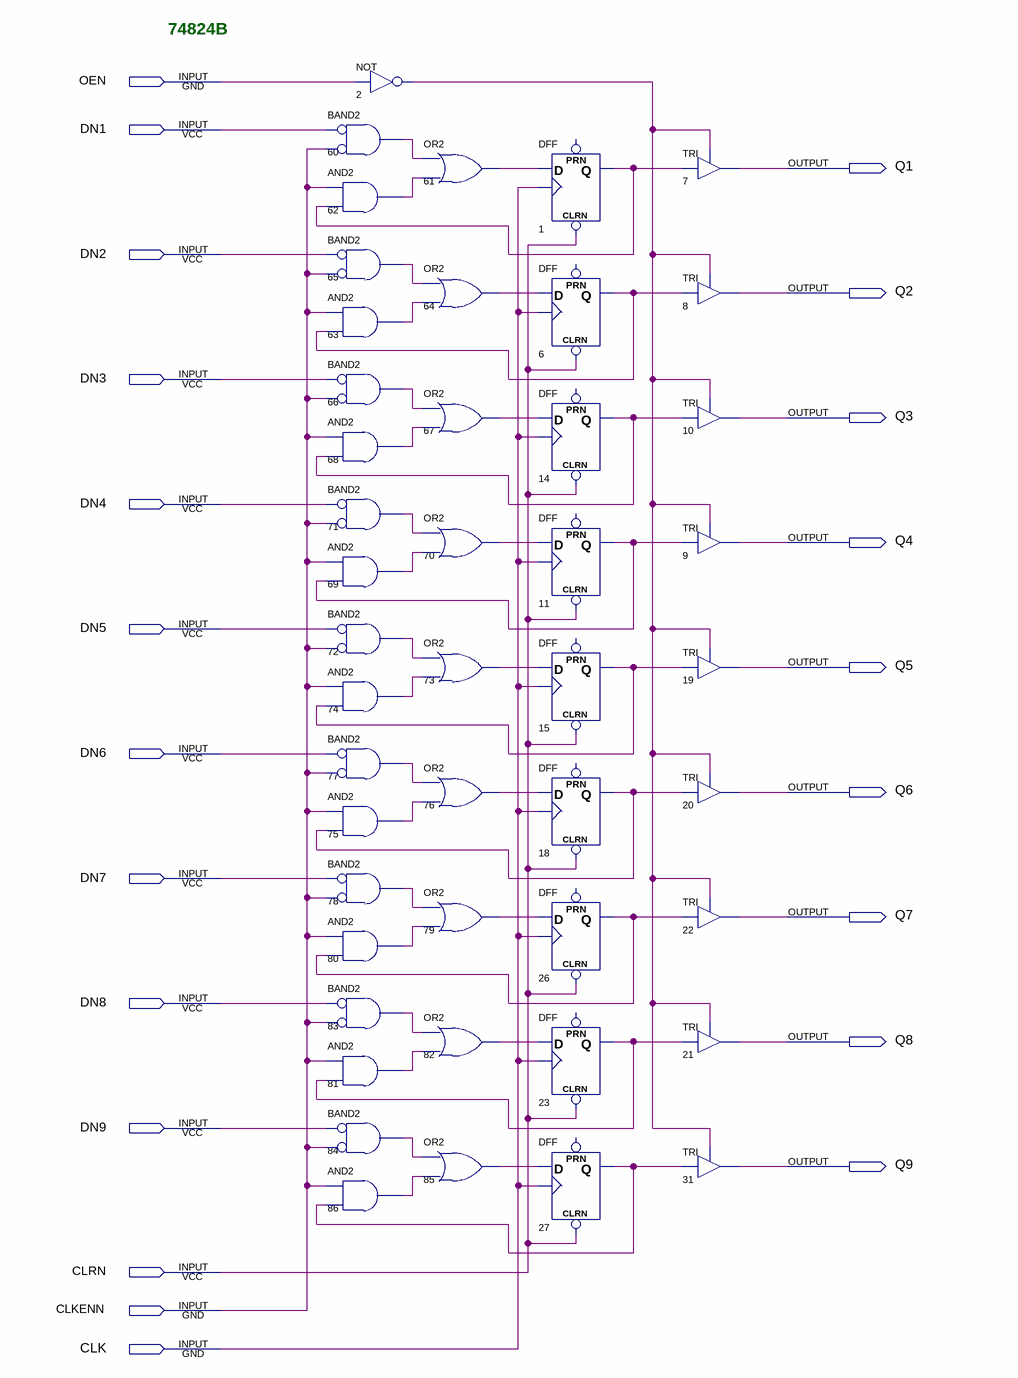
[diagram p0: schematic sheet]
// Quartus schematic 74824b.bdf as structural Verilog: 46 symbols, 22 pins
module \74824b  (
  input  OEN,
  input  DN1,
  input  DN2,
  input  DN3,
  input  DN4,
  input  DN5,
  input  DN6,
  input  DN7,
  input  DN8,
  input  DN9,
  input  CLRN,
  input  CLKENN,
  input  CLK,
  output Q1,
  output Q2,
  output Q3,
  output Q4,
  output Q5,
  output Q6,
  output Q7,
  output Q8,
  output Q9
);

  wire n1_q, n2_out, n6_q, n11_q, n14_q, n15_q, n18_q, n23_q, n26_q, n27_q, n60_out, n61_out, n62_out,
       n63_out, n64_out, n65_out, n66_out, n67_out, n68_out, n69_out, n70_out, n71_out, n72_out, n73_out,
       n74_out, n75_out, n76_out, n77_out, n78_out, n79_out, n80_out, n81_out, n82_out, n83_out, n84_out,
       n85_out, n86_out;

  not u_2 (n2_out, OEN);
  and u_60 (n60_out, ~DN1, ~CLKENN);  // BAND2
  and u_62 (n62_out, CLKENN, n1_q);
  and u_65 (n65_out, ~DN2, ~CLKENN);  // BAND2
  and u_63 (n63_out, CLKENN, n6_q);
  and u_66 (n66_out, ~DN3, ~CLKENN);  // BAND2
  and u_68 (n68_out, CLKENN, n14_q);
  and u_71 (n71_out, ~DN4, ~CLKENN);  // BAND2
  and u_69 (n69_out, CLKENN, n11_q);
  and u_72 (n72_out, ~DN5, ~CLKENN);  // BAND2
  and u_74 (n74_out, CLKENN, n15_q);
  and u_77 (n77_out, ~DN6, ~CLKENN);  // BAND2
  and u_75 (n75_out, CLKENN, n18_q);
  and u_78 (n78_out, ~DN7, ~CLKENN);  // BAND2
  and u_80 (n80_out, CLKENN, n26_q);
  and u_83 (n83_out, ~DN8, ~CLKENN);  // BAND2
  and u_81 (n81_out, CLKENN, n23_q);
  and u_84 (n84_out, ~DN9, ~CLKENN);  // BAND2
  and u_86 (n86_out, CLKENN, n27_q);
  or u_61 (n61_out, n60_out, n62_out);
  or u_64 (n64_out, n65_out, n63_out);
  or u_67 (n67_out, n66_out, n68_out);
  or u_70 (n70_out, n71_out, n69_out);
  or u_73 (n73_out, n72_out, n74_out);
  or u_76 (n76_out, n77_out, n75_out);
  or u_79 (n79_out, n78_out, n80_out);
  or u_82 (n82_out, n83_out, n81_out);
  or u_85 (n85_out, n84_out, n86_out);
  DFF u_1 (.CLRN(CLRN), .CLK(CLK), .D(n61_out), .Q(n1_q));  // open: PRN
  DFF u_6 (.CLRN(CLRN), .CLK(CLK), .D(n64_out), .Q(n6_q));  // open: PRN
  DFF u_14 (.CLRN(CLRN), .CLK(CLK), .D(n67_out), .Q(n14_q));  // open: PRN
  DFF u_11 (.CLRN(CLRN), .CLK(CLK), .D(n70_out), .Q(n11_q));  // open: PRN
  DFF u_15 (.CLRN(CLRN), .CLK(CLK), .D(n73_out), .Q(n15_q));  // open: PRN
  DFF u_18 (.CLRN(CLRN), .CLK(CLK), .D(n76_out), .Q(n18_q));  // open: PRN
  DFF u_26 (.CLRN(CLRN), .CLK(CLK), .D(n79_out), .Q(n26_q));  // open: PRN
  DFF u_23 (.CLRN(CLRN), .CLK(CLK), .D(n82_out), .Q(n23_q));  // open: PRN
  DFF u_27 (.CLRN(CLRN), .CLK(CLK), .D(n85_out), .Q(n27_q));  // open: PRN
  TRI u_7 (.IN(n1_q), .OE(n2_out), .OUT(Q1));
  TRI u_8 (.IN(n6_q), .OE(n2_out), .OUT(Q2));
  TRI u_10 (.IN(n14_q), .OE(n2_out), .OUT(Q3));
  TRI u_9 (.IN(n11_q), .OE(n2_out), .OUT(Q4));
  TRI u_19 (.IN(n15_q), .OE(n2_out), .OUT(Q5));
  TRI u_20 (.IN(n18_q), .OE(n2_out), .OUT(Q6));
  TRI u_22 (.IN(n26_q), .OE(n2_out), .OUT(Q7));
  TRI u_21 (.IN(n23_q), .OE(n2_out), .OUT(Q8));
  TRI u_31 (.IN(n27_q), .OE(n2_out), .OUT(Q9));

  // Notes on the sheet:
  //   74824B
endmodule
